# Altium project FlexV1.PrjPcb (part 1 of 3)
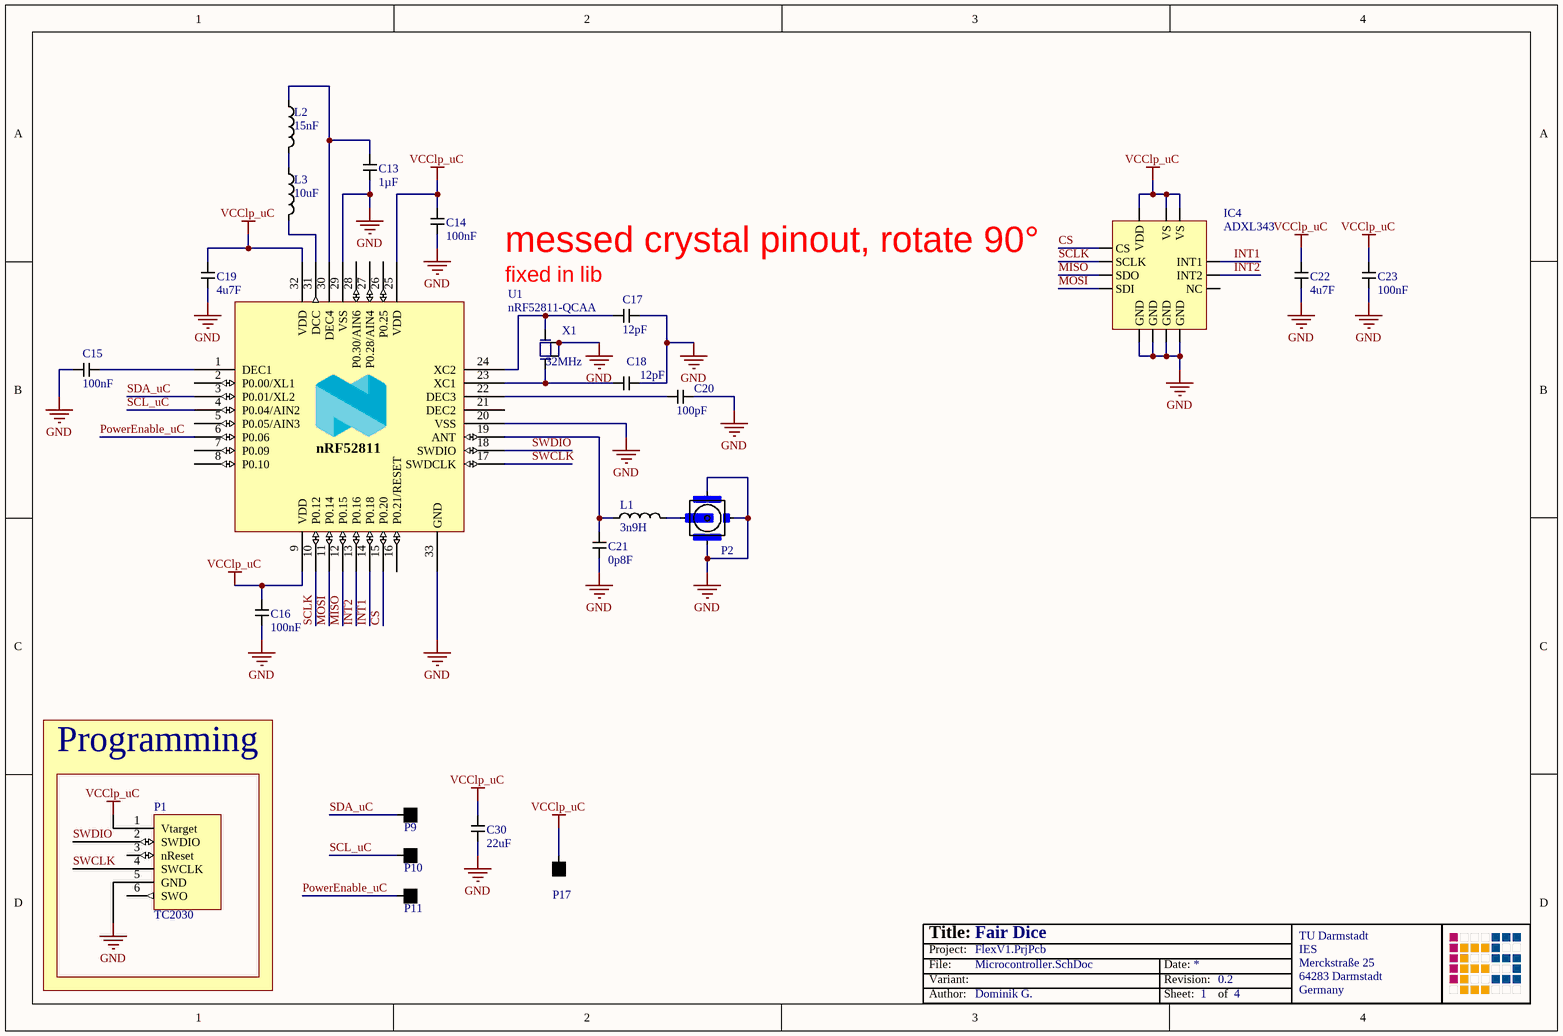
[diagram p0: Microcontroller.SchDoc]
ProjectAuthor: Dominik G.; ProjectRevision: 0.2; ProjectTitle: Fair Dice
4 sheets, 484 parts. Net scope: global (net labels, ports and power ports of the same name join across sheets).
Board files: FlexV1.PcbDoc, FlexV1_PanelV2.PcbDoc, FlexV1_Panel.PcbDoc
Sheets:
  Microcontroller.SchDoc
  LEDController.SchDoc
  PowerMM.SchDoc
  LEDs.SchDoc

## Sheet Microcontroller.SchDoc
size A4; Organization: TU Darmstadt; Address1: IES; Address2: Merckstraße 25; Address3: 64283 Darmstadt; Address4: Germany; SheetNumber: 1; SheetTotal: 4

### Parts
C13  1µF  [CL10B104KB8NNNC]
C14  100nF  [CL10B104KB8NNNC]
C15  100nF  [CL10B104KB8NNNC]
C16  100nF  [CL10B104KB8NNNC]
C17  12pF  [CL10B104KB8NNNC]
C18  12pF  [CL10B104KB8NNNC]
C19  4u7F  [C0805]
C20  100pF  [CL10B104KB8NNNC]
C21  0p8F  [CL10B104KB8NNNC]
C22  4u7F  [C0805]
C23  100nF  [CL10B104KB8NNNC]
C30  22uF  [C0805]
IC4  ADXL343  [ADXL343]
L1  3n9H  [LQW18AN3N9B80D]
L2  15nF  [RC0603]
L3  10uF  [RC0603]
P1  TC2030  [TAG_CONNECT]  (no BOM)
P2  73412-0110  [UFL]  (value not drawn)
P9  Solderpad  [SolderPad]  (value not drawn)  (no BOM)
P10  Solderpad  [SolderPad]  (value not drawn)  (no BOM)
P11  Solderpad  [SolderPad]  (value not drawn)  (no BOM)
P17  Solderpad  [SolderPad]  (value not drawn)  (no BOM)
U1  nRF52811-QCAA  [Nordic_QFN50P500X500X90-33N]
X1  32MHz  [R2520-32.000-8-F-1030-EXT-TR]

### Blocks framed on the sheet
Programming: P1

### Nets
GND: C13.1 C14.1 C15.2 C16.1 C17.2 C18.2 C19.1 C20.2 C21.1 C22.1 C23.1 C30.1 IC4.2(GND) IC4.4(GND) IC4.5(GND) IC4.11(GND) P1.5(GND) P2.2(Vout) P2.3(Vout) P2.4(Vout) U1.20(VSS) U1.29(VSS) U1.33(GND) X1.2(GND) X1.4(GND)
VCClp_uC: C14.2 C16.2 C19.2 C22.2 C23.2 C30.2 IC4.1(VDD) IC4.3(VS) IC4.6(VS) P1.1(Vtarget) P17.1 U1.9(VDD) U1.25(VDD) U1.32(VDD)
CS: IC4.7(CS) U1.15(P0.20)
INT1: IC4.8(INT1) U1.14(P0.18)
INT2: IC4.9(INT2) U1.13(P0.16)
MISO: IC4.12(SDO) U1.12(P0.15)
MOSI: IC4.13(SDI) U1.11(P0.14)
PowerEnable_uC: P11.1 U1.6(P0.06)
SCL_uC: P10.1 U1.4(P0.04/AIN2)
SCLK: IC4.14(SCLK) U1.10(P0.12)
SDA_uC: P9.1 U1.3(P0.01/XL2)
SWCLK: P1.4(SWCLK) U1.17(SWDCLK)
SWDIO: P1.2(SWDIO) U1.18(SWDIO)
NetC13_2: C13.2 L2.1(X) U1.30(DEC4)
NetC15_1: C15.1 U1.1(DEC1)
NetC17_1: C17.1 U1.24(XC2) X1.3(HOT)
NetC18_1: C18.1 U1.23(XC1) X1.1(HOT)
NetC20_1: C20.1 U1.22(DEC3)
NetC21_2: C21.2 L1.1(X) U1.19(ANT)
NetL1_2: L1.2(X) P2.1(Vout)
NetL2_2: L2.2(X) L3.1(X)
NetL3_2: L3.2(X) U1.31(DCC)

Not connected (* = marked no-connect by the designer): IC4 10(NC); P1 3(nReset) 6(SWO); U1 2(P0.00/XL1) 5(P0.05/AIN3) 7(P0.09) 8(P0.10) 16(P0.21/RESET) 21(DEC2) 26(P0.25) 27(P0.28/AIN4) 28(P0.30/AIN6)

### Notes on the sheet
- (near IC4) messed crystal pinout, rotate 90°
- fixed in lib
- Title:
- File:
- Project:
- Variant:
- Date:
- Revision:
- Author:
- Sheet:
- of
- (in symbol nRF52811_QCAA) nRF52811

### Library data of the parts
C13 = CL10A105KA8NNNC: Cap Ceramic 1uF 25V X5R 10% Pad SMD 0603 85°C T/R; Manufacturer: Samsung; Supplier 1: Digi-Key; Manufacturer Part Number: CL10A105KA8NNNC; Stock 1: 5127242; Pricing 1: 1 = 0,100000, 10 = 0,041000, 100 = 0,018500, 500 = 0,013200, 1000 = 0,010370 (USD); RoHS: Yes; Mount: Surface Mount; Case/Package: 0603; Case Code (Metric): 1608; Case Code (Imperial): 0603; Material: Ceramic; Contact Plating: Tin; Min Operating Temperature: -55°C; Max Operating Temperature: 85°C; Capacitance: 1uF; Tolerance: 10%; Dielectric: X5R; Voltage: 25V; Voltage Rating (DC): 25V; Packaging: Tape and Reel; Package Quantity: 1; Voltage Rating: 25V; Length: 1.6mm; Height: 0.8mm; Depth: 0.8mm; Width: 0.031inch; Thickness: 0.035inch; Radiation Hardening: No; Lead Free: Lead Free; ComponentLink1URL: https://datasheet.ciiva.com/25801/cl10a105ka8nnnc-25801364.pdf?src-supplier=Digi-Key; ComponentLink1Description: https://datasheet.ciiva.com/25801/cl10a105ka8nnnc-25801364.pdf?src-supplier=Digi-Key; ComponentLink2URL: https://datasheet.ciiva.com/26838/getdatasheetpartid-357530-26838332.pdf?src-supplier=Verical; ComponentLink2Description: https://datasheet.ciiva.com/26838/getdatasheetpartid-357530-26838332.pdf?src-supplier=Verical; ComponentLink3URL: https://datasheet.ciiva.com/29198/458162-da-01-en-vs-kondensator-0603-29198475.pdf?src-supplier=Conrad; ComponentLink3Description: https://datasheet.ciiva.com/29198/458162-da-01-en-vs-kondensator-0603-29198475.pdf?src-supplier=Conrad; Supplier Part Number 1: 1276-1102-1-ND
C14-C16 C23 = CL10B104KB8NNNC: Capacitor: ceramic; MLCC; 100nF; 50V; X7R; ±10%; SMD; 0603; -55÷125°C; Manufacturer: Samsung; Supplier 1: Digi-Key; Manufacturer Part Number: CL10B104KB8NNNC; Stock 1: 12121642; Pricing 1: 1 = 0,10000, 10 = 0,02800, 100 = 0,01230, 500 = 0,00878, 1000 = 0,00690 (USD); RoHS: Yes; Mount: Surface Mount; Case/Package: 0603; Case Code (Metric): 1608; Case Code (Imperial): 0603; Material: Ceramic; Contact Plating: Tin; Min Operating Temperature: -55°C; Max Operating Temperature: 125°C; Tolerance: 10%; Package Quantity: 1; Packaging: Tape and Reel; Capacitance: 100nF; Dielectric: X7R; Voltage Rating: 50V; Voltage: 50V; Voltage Rating (DC): 50V; Length: 1.6mm; Height: 0.8mm; Width: 0.031inch; Depth: 0.8mm; Thickness: 0.035inch; Radiation Hardening: No; Lead Free: Lead Free; ComponentLink1URL: https://datasheet.ciiva.com/25803/cl10b104kb8nnnc-25803393.pdf?src-supplier=Digi-Key; ComponentLink1Description: https://datasheet.ciiva.com/25803/cl10b104kb8nnnc-25803393.pdf?src-supplier=Digi-Key; ComponentLink2URL: https://datasheet.ciiva.com/26838/getdatasheetpartid-89097-26838411.pdf?src-supplier=Verical; ComponentLink2Description: https://datasheet.ciiva.com/26838/getdatasheetpartid-89097-26838411.pdf?src-supplier=Verical; ComponentLink3URL: https://datasheet.ciiva.com/29198/456651-da-01-en-vs-kondensator-0605-29198839.pdf?src-supplier=Conrad; ComponentLink3Description: https://datasheet.ciiva.com/29198/456651-da-01-en-vs-kondensator-0605-29198839.pdf?src-supplier=Conrad; Supplier Part Number 1: 1276-1000-1-ND
C17 C18 = CL10C120JB8NNNC: Cap Ceramic 12pF 50VDC C0G 5% SMD 0603 Paper T/R; Manufacturer: Samsung; Voltage: 50V; Temperature Coefficient: 300ppm/°C; Supplier 1: Digi-Key; Manufacturer Part Number: CL10C120JB8NNNC; RoHS: Yes; Category: Ceramic Capacitors; Stock 1: 106067; Pricing 1: 1=0,10000, 10=0,04000, 100=0,01780, 500=0,01274, 1000=0,01001 (USD); Mount: Surface Mount; Case/Package: 0603; Case Code (Metric): 1608; Case Code (Imperial): 0603; Material: Ceramic; Contact Plating: Tin; Min Operating Temperature: -55°C; Max Operating Temperature: 125°C; Tolerance: 5%; Capacitance: 12pF; Dielectric: C0G; Voltage Rating (DC): 50V; Voltage Rating: 50V; Package Quantity: 1; Packaging: Tape and Reel; Length: 1.6mm; Height: 0.8mm; Depth: 0.8mm; Width: 0.031inch; Thickness: 0.035inch; Radiation Hardening: No; Lead Free: Lead Free; ComponentLink1URL: https://datasheet.ciiva.com/25803/cl10c120jb8nnnc-25803312.pdf?src-supplier=Digi-Key; ComponentLink1Description: https://datasheet.ciiva.com/25803/cl10c120jb8nnnc-25803312.pdf?src-supplier=Digi-Key; ComponentLink2URL: https://datasheet.ciiva.com/26838/getdatasheetpartid-640658-26838491.pdf?src-supplier=Verical; ComponentLink2Description: https://datasheet.ciiva.com/26838/getdatasheetpartid-640658-26838491.pdf?src-supplier=Verical; ComponentLink3URL: https://datasheet.ciiva.com/29198/457317-da-01-en-vs-kondensator-0603-29198780.pdf?src-supplier=Conrad; ComponentLink3Description: https://datasheet.ciiva.com/29198/457317-da-01-en-vs-kondensator-0603-29198780.pdf?src-supplier=Conrad; Supplier Part Number 1: 1276-1254-1-ND
C19 C22 = CL21A475KAQNNNE: SAMSUNG ELECTRO-MECHANICS - CL21A475KAQNNNE - SMD Multilayer Ceramic Capacitor, 4.7 µF, 25 V, 0805 [2012 Metric], ± 10%, X5R, CL Series; Voltage Rating (DC): 25V; Capacitance: 4.7uF; Supplier 1: Digi-Key; Manufacturer: Samsung; Manufacturer Part Number: CL21A475KAQNNNE; RoHS: Yes; Category: Ceramic Capacitors; Stock 1: 481244; Pricing 1: 1=0,14000, 10=0,10000, 100=0,04680, 500=0,03282, 1000=0,02716 (USD); Mount: Surface Mount; Case/Package: 0805; Case Code (Metric): 2012; Case Code (Imperial): 0805; Min Operating Temperature: -55°C; Max Operating Temperature: 85°C; Dielectric: X5R; Package Quantity: 1; Packaging: Tape and Reel; Tolerance: 10%; Voltage Rating: 25V; Length: 2mm; Height: 1.25mm; Thickness: 0.055inch; Depth: 1.25mm; Width: 0.049inch; Radiation Hardening: No; Lead Free: Lead Free; ComponentLink1URL: https://datasheet.ciiva.com/25798/cl21a475kaqnnne-25798882.pdf?src-supplier=Digi-Key; ComponentLink1Description: https://datasheet.ciiva.com/25798/cl21a475kaqnnne-25798882.pdf?src-supplier=Digi-Key; Supplier Part Number 1: 1276-1244-1-ND
C20 = CL10B101KB8NNNC: CAP CER 100PF 50V X7R 0603; Manufacturer: Samsung; Tolerance: 10%; Supplier 1: Digi-Key; Manufacturer Part Number: CL10B101KB8NNNC; RoHS: Yes; Category: Ceramic Capacitors; Stock 1: 202639; Pricing 1: 1=0,10000, 10=0,05000, 100=0,02240, 500=0,01602, 1000=0,01258 (USD); Mount: Surface Mount; Case/Package: 0603; Case Code (Imperial): 0603; Case Code (Metric): 1608; Min Operating Temperature: -55°C; Max Operating Temperature: 125°C; Dielectric: X7R; Capacitance: 100pF; Packaging: Tape and Reel; Package Quantity: 1; Voltage Rating: 50V; Length: 1.6mm; Height: 0.8mm; Thickness: 0.035inch; Depth: 0.8mm; Width: 0.031inch; Radiation Hardening: No; ComponentLink1URL: https://datasheet.ciiva.com/26920/getdatasheetpartid-690677-26920180.pdf?src-supplier=Verical; ComponentLink1Description: https://datasheet.ciiva.com/26920/getdatasheetpartid-690677-26920180.pdf?src-supplier=Verical; ComponentLink2URL: https://datasheet.ciiva.com/16437/cl05b104kq5nnnc-16437324.pdf?src-supplier=Future+Electronics; ComponentLink2Description: https://datasheet.ciiva.com/16437/cl05b104kq5nnnc-16437324.pdf?src-supplier=Future+Electronics; Supplier Part Number 1: 1276-1909-1-ND
C21 = CBR06C808BAGAC: CAP CER 0.8PF 250V C0G/NP0 0603; Manufacturer: KEMET; Dielectric: C0G; Supplier 1: Digi-Key; Manufacturer Part Number: CBR06C808BAGAC; RoHS: Yes; Category: Ceramic Capacitors; Stock 1: 2795; Pricing 1: 1=0,54000, 10=0,37200, 100=0,22310, 500=0,16736, 1000=0,14133 (USD); Mount: Surface Mount; Case/Package: 0603; Weight: 7.1E-05oz; Case Code (Metric): 1608; Case Code (Imperial): 0603; Min Operating Temperature: -55°C; Max Operating Temperature: 125°C; Voltage Rating (DC): 250V; Packaging: Tape and Reel; Package Quantity: 1; Capacitance: 0.8pF; Voltage Rating: 250V; Termination: SMD/SMT; Length: 0.063inch; Height: 0.8mm; Width: 0.031inch; Thickness: 0.034inch; ComponentLink1URL: https://datasheet.ciiva.com/6257/kem-c1030-cbr-smd-6257781.pdf?src-supplier=Digi-Key; ComponentLink1Description: https://datasheet.ciiva.com/6257/kem-c1030-cbr-smd-6257781.pdf?src-supplier=Digi-Key; ComponentLink2URL: https://datasheet.ciiva.com/6257/kem-c1030-cbr-smd-6257783.pdf?src-supplier=Digi-Key; ComponentLink2Description: https://datasheet.ciiva.com/6257/kem-c1030-cbr-smd-6257783.pdf?src-supplier=Digi-Key; Supplier Part Number 1: 399-8836-1-ND
C30 = C2012X7S1A226M125AC: TDK - C2012X7S1A226M125AC - SMD Multilayer Ceramic Capacitor, 22 µF, 10 V, 0805 [2012 Metric], ± 20%, X7S, C Series TDK; Voltage Rating (DC): 10V; Supplier 1: Digi-Key; Manufacturer: TDK; Manufacturer Part Number: C2012X7S1A226M125AC; RoHS: Yes; Category: Ceramic Capacitors; Stock 1: 665121; Pricing 1: 1=0,97000, 10=0,74000, 100=0,52940, 500=0,40986, 1000=0,35294 (USD); Mount: Surface Mount; Case/Package: 0805; Weight: 0.000194oz; Case Code (Imperial): 0805; Dielectric Material: Ceramic; Case Code (Metric): 2012; Min Operating Temperature: -55°C; Max Operating Temperature: 125°C; Termination: SMD/SMT; Package Quantity: 2000; Packaging: Tape and Reel; Capacitance: 22uF; Tolerance: 20%; Voltage Rating: 10V; Dielectric: X7S; Length: 0.079inch; Height: 1.25mm; Width: 1.25mm; Thickness: 0.057inch; Lead Free: Lead Free; REACH SVHC: No SVHC; ComponentLink1URL: https://datasheet.ciiva.com/14893/tdkmlcccaprange-14893287.pdf?src-supplier=Digi-Key; ComponentLink1Description: https://datasheet.ciiva.com/14893/tdkmlcccaprange-14893287.pdf?src-supplier=Digi-Key; ComponentLink2URL: https://datasheet.ciiva.com/14893/tdkmlcccaprange-14893288.pdf?src-supplier=Digi-Key; ComponentLink2Description: https://datasheet.ciiva.com/14893/tdkmlcccaprange-14893288.pdf?src-supplier=Digi-Key; ComponentLink3URL: https://datasheet.ciiva.com/14893/tdkmlcccaprange-14893289.pdf?src-supplier=Digi-Key; ComponentLink3Description: https://datasheet.ciiva.com/14893/tdkmlcccaprange-14893289.pdf?src-supplier=Digi-Key; Supplier Part Number 1: 445-14560-1-ND
IC4 = ADXL343BCCZ-RL: ACCEL 2-16G I2C/SPI 14LGA; Manufacturer: Analog Devices; Max Supply Voltage: 3.6V; Min Supply Voltage: 2V; Nominal Supply Current: 140uA; Bandwidth: 0.05Hz; -3db Bandwidth: 320Hz; Output Type: Digital; Axis: X, Y, Z; Sensitivity: 256LSB/g; Supplier 1: Digi-Key; Manufacturer Part Number: ADXL343BCCZ-RL; RoHS: Yes; Category: Sensors; Stock 1: 1661; Pricing 1: 1=3,50000, 10=3,14200, 25=2,97000, 100=2,57400, 500=2,19120, 1000=1,91400 (USD); Case/Package: LGA; Number of Pins: 14; Contact Plating: Tin,Matte; Min Operating Temperature: -40°C; Max Operating Temperature: 85°C; Package Quantity: 5000; Packaging: Tape and Reel; Lead Free: Contains Lead; ComponentLink1URL: https://datasheet.ciiva.com/6484/adxl343-6484390.pdf?src-supplier=Digi-Key; ComponentLink1Description: https://datasheet.ciiva.com/6484/adxl343-6484390.pdf?src-supplier=Digi-Key; ComponentLink2URL: https://datasheet.ciiva.com/16638/adxl343-16638169.pdf?src-supplier=Avnet+Europe; ComponentLink2Description: https://datasheet.ciiva.com/16638/adxl343-16638169.pdf?src-supplier=Avnet+Europe; Supplier Part Number 1: ADXL343BCCZ-RLCT-ND
L1 = LQW18AN3N9B80D: Ind RF Chip Unshielded Wirewound 3.9nH 0.1nH 100MHz 30Q-Factor Ferrite 2.2A 0603 Paper T/R; Manufacturer: Murata; DC Resistance (DCR): 28mR; Self Resonant Frequency: 10GHz; Supplier 1: Digi-Key; Manufacturer Part Number: LQW18AN3N9B80D; RoHS: Yes; Category: Fixed Inductors; Stock 1: 1312; Pricing 1: 1=0,28000, 10=0,24800, 100=0,17080, 500=0,14594, 1000=0,11178 (USD); Mount: Surface Mount; Case/Package: 0603; Core Material: Ferrite; Min Operating Temperature: -55°C; Max Operating Temperature: 125°C; Packaging: Tape and Reel; Composition: Wirewound; Inductance: 3.9nH; Current Rating: 2.2A; Shielding: Unshielded; Test Frequency: 100MHz; Length: 0.065inch; Width: 0.039inch; Height - Seated (Max): 0.039inch; ComponentLink1URL: https://search.murata.co.jp/Ceramy/image/img/P02/JELF243A-0102.pdf?src-supplier=Digi-Key; ComponentLink1Description: https://search.murata.co.jp/Ceramy/image/img/P02/JELF243A-0102.pdf?src-supplier=Digi-Key; ComponentLink2URL: http://search.murata.co.jp/Ceramy/image/img/P02/JELF243A-0082.pdf?src-supplier=Digi-Key; ComponentLink2Description: http://search.murata.co.jp/Ceramy/image/img/P02/JELF243A-0082.pdf?src-supplier=Digi-Key; Supplier Part Number 1: 490-16894-1-ND
L2 = LQW18AN15NJ10D: Inductor RF Chip Wirewound 15nH 5% 100MHz 42Q-Factor 700mA 85mOhm DCR 0603 Paper T/R; Manufacturer: Murata; Core Material: Non-Magnetic; Q Factor: 42; Self Resonant Frequency: 4.5GHz; DC Resistance (DCR): 85mR; Current: 1A; Shielding: Unshielded; Supplier 1: Digi-Key; Manufacturer Part Number: LQW18AN15NJ10D; RoHS: Yes; Category: Fixed Inductors; Stock 1: 5086; Pricing 1: 1=0,19000, 10=0,17100, 100=0,11390, 500=0,09488, 1000=0,07970 (USD); Mount: Surface Mount; Case/Package: 0603; Weight: 0.000106oz; Case Code (Metric): 1608; Case Code (Imperial): 0603; Min Operating Temperature: -55°C; Max Operating Temperature: 125°C; Packaging: Tape and Reel; Composition: Wirewound; Inductance: 15nH; Test Frequency: 100MHz; Max DC Current: 700mA; Termination: SMD/SMT; DC Current: 700mA; Military Standard: Not; Package Quantity: 4000; Current Rating: 700mA; Tolerance: 5%; Length: 1.6mm; Height: 0.8mm; Height - Seated (Max): 0.039inch; Depth: 1.1mm; Width: 0.031inch; Radiation Hardening: No; ComponentLink1URL: https://datasheet.ciiva.com/11801/0900766b80a002db-11801459.pdf?src-supplier=RSComponents; ComponentLink1Description: https://datasheet.ciiva.com/11801/0900766b80a002db-11801459.pdf?src-supplier=RSComponents; ComponentLink2URL: https://datasheet.ciiva.com/6705/l0075s0080lqw18a-10-6705463.pdf?src-supplier=Digi-Key; ComponentLink2Description: https://datasheet.ciiva.com/6705/l0075s0080lqw18a-10-6705463.pdf?src-supplier=Digi-Key; ComponentLink3URL: https://datasheet.ciiva.com/17247/l0075s0080lqw18a-10-17247742.pdf?src-supplier=Avnet+Europe; ComponentLink3Description: https://datasheet.ciiva.com/17247/l0075s0080lqw18a-10-17247742.pdf?src-supplier=Avnet+Europe; Supplier Part Number 1: 490-6867-1-ND
L3 = MLZ1608N100LT000: Inductor Power Shielded Multi-Layer 10uH 20% 2MHz Ferrite 0.06A 0.78Ohm DCR 0603 T/R; Manufacturer: TDK; DC Resistance (DCR): 780mR; Self Resonant Frequency: 50MHz; Current Rating: 300mA; Saturation Current: 60mA; Supplier 1: Digi-Key; Manufacturer Part Number: MLZ1608N100LT000; RoHS: Yes; Category: Fixed Inductors; Stock 1: 163600; Pricing 1: 1=0,17000, 10=0,15500, 100=0,10350, 500=0,08626, 1000=0,07245 (USD); Mount: Surface Mount; Case/Package: 0603; Case Code (Imperial): 0603; Case Code (Metric): 1608; Core Material: Ferrite; Min Operating Temperature: -55°C; Max Operating Temperature: 125°C; Inductance: 10uH; Test Frequency: 2MHz; Package Quantity: 4000; Packaging: Tape and Reel; Tolerance: 20%; Shielding: Shielded; Length: 0.063inch; Height - Seated (Max): 0.037inch; Width: 0.031inch; Lead Free: Lead Free; ComponentLink1URL: https://datasheet.ciiva.com/29698/inductor-commercial-decoupling-mlz-en-29698853.pdf?src-supplier=Digi-Key; ComponentLink1Description: https://datasheet.ciiva.com/29698/inductor-commercial-decoupling-mlz-en-29698853.pdf?src-supplier=Digi-Key; ComponentLink2URL: https://datasheet.ciiva.com/29698/inductor-commercial-decoupling-mlz-en-29698854.pdf?src-supplier=Digi-Key; ComponentLink2Description: https://datasheet.ciiva.com/29698/inductor-commercial-decoupling-mlz-en-29698854.pdf?src-supplier=Digi-Key; ComponentLink3URL: https://datasheet.ciiva.com/29698/inductor-commercial-decoupling-mlz-en-29698855.pdf?src-supplier=Digi-Key; ComponentLink3Description: https://datasheet.ciiva.com/29698/inductor-commercial-decoupling-mlz-en-29698855.pdf?src-supplier=Digi-Key; Supplier Part Number 1: 445-6755-1-ND
P2 = 73412-0110: MOLEX   73412-0110   RF COAXIAL, MICROCOAXIAL, JACK, 50OHM; Body Material: Polymer,Liquid Crystal Polymer; Body Plating: Gold; Impedance: 50R; Voltage Rating: 60V; Frequency: 6GHz; Gender: Female; Mating Cycles: 30; Insulation Resistance: 500MR; Polarity: Standard; Supplier 1: Digi-Key; Manufacturer: Molex; Manufacturer Part Number: 73412-0110; RoHS: Yes; Category: RF / Coaxial Connectors; Stock 1: 79788; Pricing 1: 1=0,77000, 10=0,72200, 25=0,64960, 50=0,57740, 100=0,55330, 250=0,50520, 500=0,48114, 1000=0,39694, 2500=0,36086 (USD); Mount: Surface Mount,Through Hole,PCB; Contact Material: Bronze,Brass; Contact Plating: Gold; Material: Bronze; Min Operating Temperature: -40°C; Max Operating Temperature: 90°C; Package Quantity: 5000; Packaging: Tape and Reel; Max Frequency: 6GHz; Termination: Solder; Connector Type: Coaxial; Voltage Rating (AC): 60V; Orientation: Straight; Radiation Hardening: No; REACH SVHC: Unknown; Halogen Free: Low Halogen; Lead Free: Lead Free; ComponentLink1URL: https://datasheet.ciiva.com/30219/250360734120110-rf-coax-nectors-30219809.pdf?src-supplier=Onlinecomponents.com; ComponentLink1Description: https://datasheet.ciiva.com/30219/250360734120110-rf-coax-nectors-30219809.pdf?src-supplier=Onlinecomponents.com; ComponentLink2URL: https://datasheet.ciiva.com/16653/0734120110-rf-coax-connectors-16653186.pdf?src-supplier=Avnet+Europe; ComponentLink2Description: https://datasheet.ciiva.com/16653/0734120110-rf-coax-connectors-16653186.pdf?src-supplier=Avnet+Europe; ComponentLink3URL: https://datasheet.ciiva.com/11762/0900766b80dfdeb4-11762356.pdf?src-supplier=RSComponents; ComponentLink3Description: https://datasheet.ciiva.com/11762/0900766b80dfdeb4-11762356.pdf?src-supplier=RSComponents; ComponentLink4URL: https://datasheet.ciiva.com/22773/1841262-22773140.pdf?src-supplier=Farnell; ComponentLink4Description: https://datasheet.ciiva.com/22773/1841262-22773140.pdf?src-supplier=Farnell; ComponentLink5URL: https://datasheet.ciiva.com/4600/0734120110-rf-coax-connectors-173239-4600647.pdf?src-supplier=Mouser; ComponentLink5Description: https://datasheet.ciiva.com/4600/0734120110-rf-coax-connectors-173239-4600647.pdf?src-supplier=Mouser; ComponentLink6URL: https://datasheet.ciiva.com/16081/1387750734120110-rf-coax-nectors-16081145.pdf?src-supplier=Onlinecomponents.com; ComponentLink6Description: https://datasheet.ciiva.com/16081/1387750734120110-rf-coax-nectors-16081145.pdf?src-supplier=Onlinecomponents.com; ComponentLink7URL: https://datasheet.ciiva.com/46384/1808577-46384459.pdf?src-supplier=Element14; ComponentLink7Description: https://datasheet.ciiva.com/46384/1808577-46384459.pdf?src-supplier=Element14; ComponentLink8URL: https://datasheet.ciiva.com/9419/0734120110-rf-coax-connectors-9419357.pdf?src-supplier=Avnet; ComponentLink8Description: https://datasheet.ciiva.com/9419/0734120110-rf-coax-connectors-9419357.pdf?src-supplier=Avnet; Supplier Part Number 1: WM5587CT-ND
U1 = nRF52811_QCAA: Multi-protocol Bluetooth Low Energy, IEEE 802.15.4, ANT and 2.4GHz proprietary system-on-chip; Part Number: nRF52811-QCAAA0; Manufacturer: Nordic Semiconductor; Manufacturer Part Number: nRF52811-QCAAA0; LatestRevisionDate: 2019-01-30; Pin Count: 32; Publisher: Nordic Semiconductor; Published: 2019-01-30; Value: nRF52811-QCAA; Footprint Doc: QFN-32
X1 = R2520-32.000-8-F-1030-EXT-TR: Xtal 32MHZ 8PF SMD; Manufacturer: Raltron Electronics; Supplier 1: Digi-Key; Manufacturer Part Number: R2520-32.000-8-F-1030-EXT-TR; Stock 1: 2968; Pricing 1: 1=0,68000, 10=0,59800, 50=0,55900, 100=0,49400, 500=0,46800, 1000=0,39000 (USD); ComponentLink1URL: http://datasheet.octopart.com/R2520-32.000-8-F-1030-EXT-TR-Raltron-Electronics-datasheet-137142235.pdf?src-supplier=Raltron+Electronics; ComponentLink1Description: http://datasheet.octopart.com/R2520-32.000-8-F-1030-EXT-TR-Raltron-Electronics-datasheet-137142235.pdf?src-supplier=Raltron+Electronics; ComponentLink2URL: http://datasheet.octopart.com/R2520-32.000-8-F-1030-EXT-TR-Raltron-Electronics-datasheet-140254835.pdf?src-supplier=Raltron+Electronics; ComponentLink2Description: http://datasheet.octopart.com/R2520-32.000-8-F-1030-EXT-TR-Raltron-Electronics-datasheet-140254835.pdf?src-supplier=Raltron+Electronics; Supplier Part Number 1: 2151-R2520-32.000-8-F-1030-EXT-TRCT-ND
P1 = TC2030: Supplier 1: Tag-Connect; Supplier Part Number 1: TC2030-CTX-20-NL

## Sheet LEDController.SchDoc
size A4; Organization: TU Darmstadt; Address1: IES; Address2: Merckstraße 25; Address3: 64283 Darmstadt; Address4: Germany
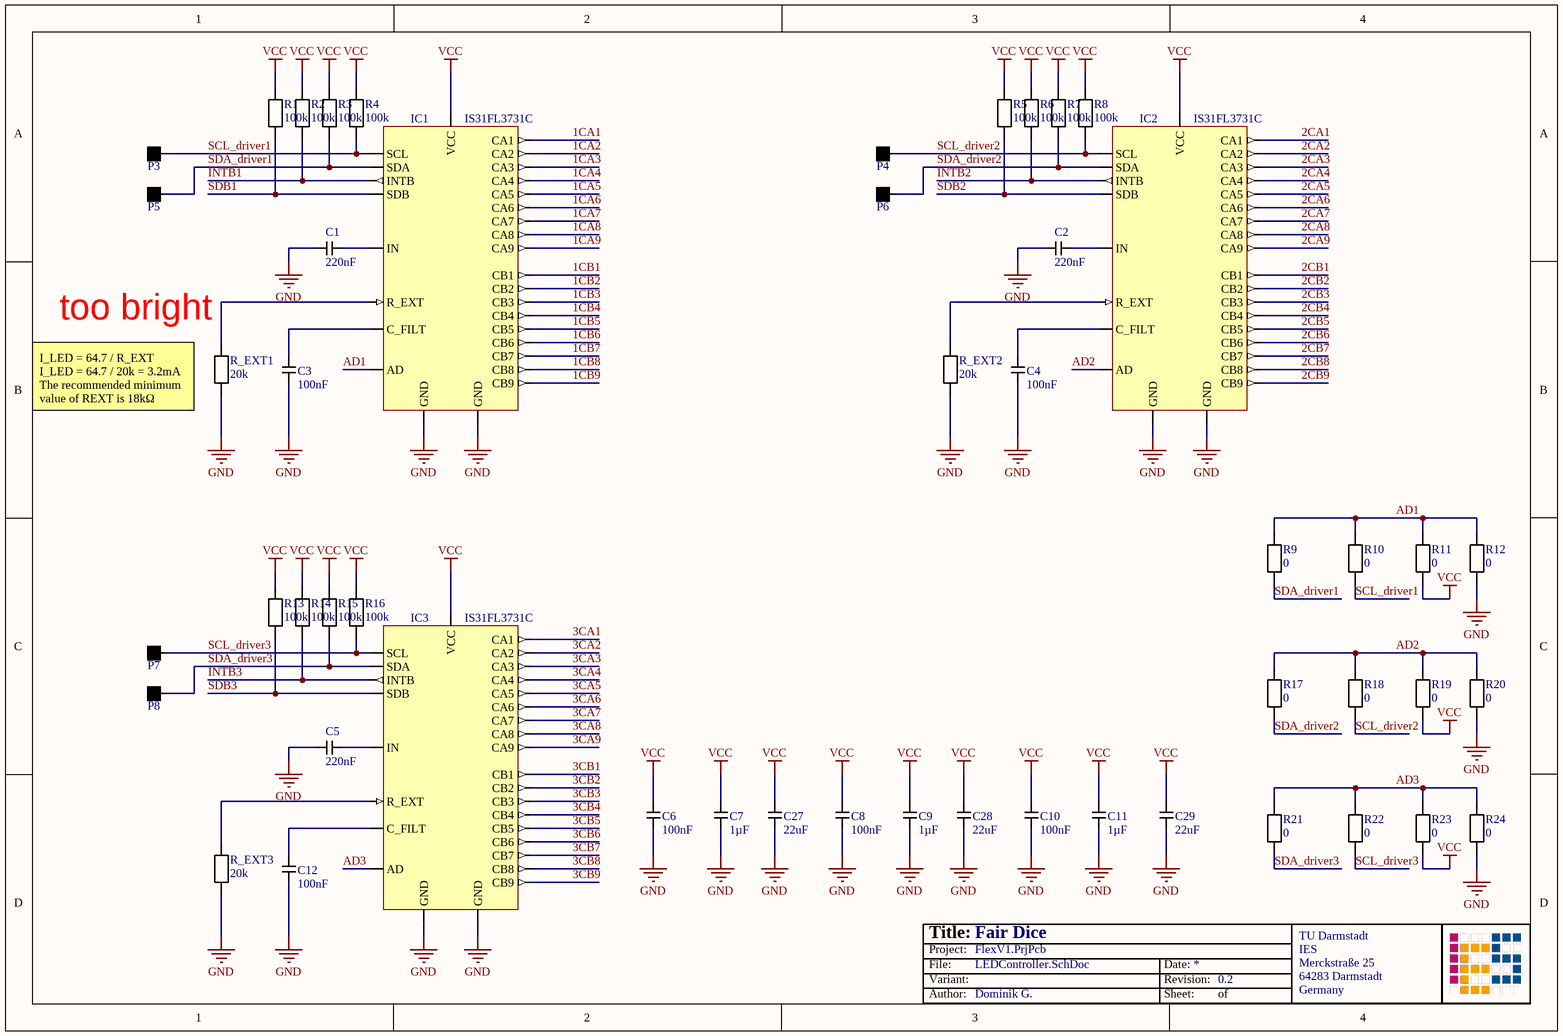
[diagram p1: LEDController.SchDoc]

### Parts
C1  220nF  [RC0402]
C2  220nF  [RC0402]
C3  100nF  [CL10B104KB8NNNC]
C4  100nF  [CL10B104KB8NNNC]
C5  220nF  [RC0402]
C6  100nF  [CL10B104KB8NNNC]
C7  1µF  [CL10B104KB8NNNC]
C8  100nF  [CL10B104KB8NNNC]
C9  1µF  [CL10B104KB8NNNC]
C10  100nF  [CL10B104KB8NNNC]
C11  1µF  [CL10B104KB8NNNC]
C12  100nF  [CL10B104KB8NNNC]
C27  22uF  [C0805]
C28  22uF  [C0805]
C29  22uF  [C0805]
IC1  IS31FL3731C  [IS31FL3731]
IC2  IS31FL3731C  [IS31FL3731]
IC3  IS31FL3731C  [IS31FL3731]
P3  Solderpad  [SolderPad]  (value not drawn)  (no BOM)
P4  Solderpad  [SolderPad]  (value not drawn)  (no BOM)
P5  Solderpad  [SolderPad]  (value not drawn)  (no BOM)
P6  Solderpad  [SolderPad]  (value not drawn)  (no BOM)
P7  Solderpad  [SolderPad]  (value not drawn)  (no BOM)
P8  Solderpad  [SolderPad]  (value not drawn)  (no BOM)
R1  100k  [RC0603]
R2  100k  [RC0603]
R3  100k  [RC0603]
R4  100k  [RC0603]
R5  100k  [RC0603]
R6  100k  [RC0603]
R7  100k  [RC0603]
R8  100k  [RC0603]
R9  0  [RC0402]
R10  0  [RC0402]
R11  0  [RC0402]
R12  0  [RC0402]
R13  100k  [RC0603]
R14  100k  [RC0603]
R15  100k  [RC0603]
R16  100k  [RC0603]
R17  0  [RC0402]
R18  0  [RC0402]
R19  0  [RC0402]
R20  0  [RC0402]
R21  0  [RC0402]
R22  0  [RC0402]
R23  0  [RC0402]
R24  0  [RC0402]
R_EXT1  20k  [RC0603]
R_EXT2  20k  [RC0603]
R_EXT3  20k  [RC0603]

### Nets
GND: C1.1 C2.1 C3.1 C4.1 C5.1 C6.1 C7.1 C8.1 C9.1 C10.1 C11.1 C12.1 C27.1 C28.1 C29.1 IC1.5(GND) IC1.29(GND) IC2.5(GND) IC2.29(GND) IC3.5(GND) IC3.29(GND) R12.1 R20.1 R24.1 R_EXT1.2 R_EXT2.2 R_EXT3.2
VCC: C6.2 C7.2 C8.2 C9.2 C10.2 C11.2 C27.2 C28.2 C29.2 IC1.2(VCC) IC2.2(VCC) IC3.2(VCC) R1.2 R2.2 R3.2 R4.2 R5.2 R6.2 R7.2 R8.2 R11.1 R13.2 R14.2 R15.2 R16.2 R19.1 R23.1
1CA1: IC1.21(CA1)
1CA2: IC1.22(CA2)
1CA3: IC1.23(CA3)
1CA4: IC1.24(CA4)
1CA5: IC1.25(CA5)
1CA6: IC1.26(CA6)
1CA7: IC1.27(CA7)
1CA8: IC1.28(CA8)
1CA9: IC1.1(CA9)
1CB1: IC1.7(CB1)
1CB2: IC1.8(CB2)
1CB3: IC1.9(CB3)
1CB4: IC1.10(CB4)
1CB5: IC1.11(CB5)
1CB6: IC1.12(CB6)
1CB7: IC1.13(CB7)
1CB8: IC1.14(CB8)
1CB9: IC1.15(CB9)
2CA1: IC2.21(CA1)
2CA2: IC2.22(CA2)
2CA3: IC2.23(CA3)
2CA4: IC2.24(CA4)
2CA5: IC2.25(CA5)
2CA6: IC2.26(CA6)
2CA7: IC2.27(CA7)
2CA8: IC2.28(CA8)
2CA9: IC2.1(CA9)
2CB1: IC2.7(CB1)
2CB2: IC2.8(CB2)
2CB3: IC2.9(CB3)
2CB4: IC2.10(CB4)
2CB5: IC2.11(CB5)
2CB6: IC2.12(CB6)
2CB7: IC2.13(CB7)
2CB8: IC2.14(CB8)
2CB9: IC2.15(CB9)
3CA1: IC3.21(CA1)
3CA2: IC3.22(CA2)
3CA3: IC3.23(CA3)
3CA4: IC3.24(CA4)
3CA5: IC3.25(CA5)
3CA6: IC3.26(CA6)
3CA7: IC3.27(CA7)
3CA8: IC3.28(CA8)
3CA9: IC3.1(CA9)
3CB1: IC3.7(CB1)
3CB2: IC3.8(CB2)
3CB3: IC3.9(CB3)
3CB4: IC3.10(CB4)
3CB5: IC3.11(CB5)
3CB6: IC3.12(CB6)
3CB7: IC3.13(CB7)
3CB8: IC3.14(CB8)
3CB9: IC3.15(CB9)
AD1: IC1.18(AD) R9.2 R10.2 R11.2 R12.2
AD2: IC2.18(AD) R17.2 R18.2 R19.2 R20.2
AD3: IC3.18(AD) R21.2 R22.2 R23.2 R24.2
INTB1: IC1.4(INTB) R2.1
INTB2: IC2.4(INTB) R6.1
INTB3: IC3.4(INTB) R14.1
SCL_driver1: IC1.20(SCL) P3.1 R4.1 R10.1
SCL_driver2: IC2.20(SCL) P4.1 R8.1 R18.1
SCL_driver3: IC3.20(SCL) P7.1 R16.1 R22.1
SDA_driver1: IC1.19(SDA) P5.1 R3.1 R9.1
SDA_driver2: IC2.19(SDA) P6.1 R7.1 R17.1
SDA_driver3: IC3.19(SDA) P8.1 R15.1 R21.1
SDB1: IC1.3(SDB) R1.1
SDB2: IC2.3(SDB) R5.1
SDB3: IC3.3(SDB) R13.1
NetC1_2: C1.2 IC1.17(IN)
NetC2_2: C2.2 IC2.17(IN)
NetC3_2: C3.2 IC1.16(C_FILT)
NetC4_2: C4.2 IC2.16(C_FILT)
NetC5_2: C5.2 IC3.17(IN)
NetC12_2: C12.2 IC3.16(C_FILT)
NetIC1_6: IC1.6(R_EXT) R_EXT1.1
NetIC2_6: IC2.6(R_EXT) R_EXT2.1
NetIC3_6: IC3.6(R_EXT) R_EXT3.1

### Notes on the sheet
- (near R_EXT1) too bright
- (near R_EXT1) I_LED = 64.7 / R_EXT
  I_LED = 64.7 / 20k = 3.2mA
  The recommended minimum value of REXT is 18kΩ
- Title:
- File:
- Project:
- Variant:
- Date:
- Revision:
- Author:
- Sheet:
- of

### Library data of the parts
C1 C2 C5 = CC0402KRX5R6BB224: CAP CER 0.22UF 10V X5R 0402; Manufacturer: Yageo; Dielectric Material: Ceramic; Tolerance: 10%; Supplier 1: Digi-Key; Manufacturer Part Number: CC0402KRX5R6BB224; Stock 1: 215238; Pricing 1: 1 = 0,10000, 10 = 0,05700, 100 = 0,02530, 500 = 0,01808, 1000 = 0,01421, 2500 = 0,01292, 5000 = 0,01188 (USD); RoHS: Yes; Mount: Surface Mount; Case/Package: 0402; Weight: 2.3E-05oz; Case Code (Metric): 1005; Case Code (Imperial): 0402; Min Operating Temperature: -55°C; Max Operating Temperature: 85°C; Package Quantity: 10000; Capacitance: 220nF; Voltage Rating: 10V; Packaging: Tape and Reel; Voltage Rating (DC): 10V; Dielectric: X5R; Termination: SMD/SMT; Composition: Ceramic; Length: 1mm; Height: 0.5mm; Width: 0.02inch; Thickness: 0.022inch; Depth: 0.5mm; Radiation Hardening: No; REACH SVHC: Unknown; Lead Free: Lead Free; Halogen Free: Halogen Free; ComponentLink1URL: https://datasheet.ciiva.com/176/mlccorderingcode-176912.pdf?src-supplier=Digi-Key; ComponentLink1Description: https://datasheet.ciiva.com/176/mlccorderingcode-176912.pdf?src-supplier=Digi-Key; ComponentLink2URL: https://datasheet.ciiva.com/176/mlccorderingcode-176913.pdf?src-supplier=Digi-Key; ComponentLink2Description: https://datasheet.ciiva.com/176/mlccorderingcode-176913.pdf?src-supplier=Digi-Key; ComponentLink3URL: https://datasheet.ciiva.com/8033/1525783-8033653.pdf?src-supplier=Element14; ComponentLink3Description: https://datasheet.ciiva.com/8033/1525783-8033653.pdf?src-supplier=Element14; ComponentLink4URL: https://datasheet.ciiva.com/16624/upy-gphc-x5r-4v-to-50v-12-16624733.pdf?src-supplier=Avnet+Europe; ComponentLink4Description: https://datasheet.ciiva.com/16624/upy-gphc-x5r-4v-to-50v-12-16624733.pdf?src-supplier=Avnet+Europe; ComponentLink5URL: https://datasheet.ciiva.com/28450/1359354-28450298.pdf?src-supplier=Element14; ComponentLink5Description: https://datasheet.ciiva.com/28450/1359354-28450298.pdf?src-supplier=Element14; ComponentLink6URL: https://datasheet.ciiva.com/176/mlccorderingcode-176911.pdf?src-supplier=Digi-Key; ComponentLink6Description: https://datasheet.ciiva.com/176/mlccorderingcode-176911.pdf?src-supplier=Digi-Key; Supplier Part Number 1: 311-1421-1-ND
C3 C4 C6 C8 C10 C12 = CL10B104KB8NNNC: as C14 on sheet Microcontroller; Supplier 1: Digi-Key; Manufacturer Part Number: CL10B104KB8NNNC; Stock 1: 12121642; Pricing 1: 1 = 0,10000, 10 = 0,02800, 100 = 0,01230, 500 = 0,00878, 1000 = 0,00690 (USD); RoHS: Yes; Mount: Surface Mount; Case/Package: 0603; Case Code (Metric): 1608; Case Code (Imperial): 0603; Material: Ceramic; Contact Plating: Tin; Min Operating Temperature: -55°C; Max Operating Temperature: 125°C; Tolerance: 10%; Package Quantity: 1; Packaging: Tape and Reel; Capacitance: 100nF; Dielectric: X7R; Voltage Rating: 50V; Voltage: 50V; Voltage Rating (DC): 50V; Length: 1.6mm; Height: 0.8mm; Width: 0.031inch; Depth: 0.8mm; Thickness: 0.035inch; Radiation Hardening: No; Lead Free: Lead Free; ComponentLink1URL: https://datasheet.ciiva.com/25803/cl10b104kb8nnnc-25803393.pdf?src-supplier=Digi-Key; ComponentLink1Description: https://datasheet.ciiva.com/25803/cl10b104kb8nnnc-25803393.pdf?src-supplier=Digi-Key; ComponentLink2URL: https://datasheet.ciiva.com/26838/getdatasheetpartid-89097-26838411.pdf?src-supplier=Verical; ComponentLink2Description: https://datasheet.ciiva.com/26838/getdatasheetpartid-89097-26838411.pdf?src-supplier=Verical; ComponentLink3URL: https://datasheet.ciiva.com/29198/456651-da-01-en-vs-kondensator-0605-29198839.pdf?src-supplier=Conrad; ComponentLink3Description: https://datasheet.ciiva.com/29198/456651-da-01-en-vs-kondensator-0605-29198839.pdf?src-supplier=Conrad; Supplier Part Number 1: 1276-1000-1-ND
C7 C9 C11 = CL10A105KA8NNNC: as C13 on sheet Microcontroller; Supplier 1: Digi-Key; Manufacturer Part Number: CL10A105KA8NNNC; Stock 1: 5127242; Pricing 1: 1 = 0,100000, 10 = 0,041000, 100 = 0,018500, 500 = 0,013200, 1000 = 0,010370 (USD); RoHS: Yes; Mount: Surface Mount; Case/Package: 0603; Case Code (Metric): 1608; Case Code (Imperial): 0603; Material: Ceramic; Contact Plating: Tin; Min Operating Temperature: -55°C; Max Operating Temperature: 85°C; Capacitance: 1uF; Tolerance: 10%; Dielectric: X5R; Voltage: 25V; Voltage Rating (DC): 25V; Packaging: Tape and Reel; Package Quantity: 1; Voltage Rating: 25V; Length: 1.6mm; Height: 0.8mm; Depth: 0.8mm; Width: 0.031inch; Thickness: 0.035inch; Radiation Hardening: No; Lead Free: Lead Free; ComponentLink1URL: https://datasheet.ciiva.com/25801/cl10a105ka8nnnc-25801364.pdf?src-supplier=Digi-Key; ComponentLink1Description: https://datasheet.ciiva.com/25801/cl10a105ka8nnnc-25801364.pdf?src-supplier=Digi-Key; ComponentLink2URL: https://datasheet.ciiva.com/26838/getdatasheetpartid-357530-26838332.pdf?src-supplier=Verical; ComponentLink2Description: https://datasheet.ciiva.com/26838/getdatasheetpartid-357530-26838332.pdf?src-supplier=Verical; ComponentLink3URL: https://datasheet.ciiva.com/29198/458162-da-01-en-vs-kondensator-0603-29198475.pdf?src-supplier=Conrad; ComponentLink3Description: https://datasheet.ciiva.com/29198/458162-da-01-en-vs-kondensator-0603-29198475.pdf?src-supplier=Conrad; Supplier Part Number 1: 1276-1102-1-ND
C27-C29 = C2012X7S1A226M125AC: as C30 on sheet Microcontroller; Supplier 1: Digi-Key; Manufacturer: TDK; Manufacturer Part Number: C2012X7S1A226M125AC; RoHS: Yes; Category: Ceramic Capacitors; Stock 1: 665121; Pricing 1: 1=0,97000, 10=0,74000, 100=0,52940, 500=0,40986, 1000=0,35294 (USD); Mount: Surface Mount; Case/Package: 0805; Weight: 0.000194oz; Case Code (Imperial): 0805; Dielectric Material: Ceramic; Case Code (Metric): 2012; Min Operating Temperature: -55°C; Max Operating Temperature: 125°C; Termination: SMD/SMT; Package Quantity: 2000; Packaging: Tape and Reel; Capacitance: 22uF; Tolerance: 20%; Voltage Rating: 10V; Dielectric: X7S; Length: 0.079inch; Height: 1.25mm; Width: 1.25mm; Thickness: 0.057inch; Lead Free: Lead Free; REACH SVHC: No SVHC; ComponentLink1URL: https://datasheet.ciiva.com/14893/tdkmlcccaprange-14893287.pdf?src-supplier=Digi-Key; ComponentLink1Description: https://datasheet.ciiva.com/14893/tdkmlcccaprange-14893287.pdf?src-supplier=Digi-Key; ComponentLink2URL: https://datasheet.ciiva.com/14893/tdkmlcccaprange-14893288.pdf?src-supplier=Digi-Key; ComponentLink2Description: https://datasheet.ciiva.com/14893/tdkmlcccaprange-14893288.pdf?src-supplier=Digi-Key; ComponentLink3URL: https://datasheet.ciiva.com/14893/tdkmlcccaprange-14893289.pdf?src-supplier=Digi-Key; ComponentLink3Description: https://datasheet.ciiva.com/14893/tdkmlcccaprange-14893289.pdf?src-supplier=Digi-Key; Supplier Part Number 1: 445-14560-1-ND
IC1-IC3 = IS31FL3731C-QFLS2-TR: LED Lighting Drivers Audio Modulated 144 Dot LED Driver; Manufacturer: ISSI; Number of Outputs: 18; Max Supply Voltage: 5.5V; Output Current per Channel: 34mA; Frequency: 400kHz; Max Supply Current: 2.17mA; High Level Output Current: 5nA; Dimming: Analog; Supplier 1: Digi-Key; Manufacturer Part Number: IS31FL3731C-QFLS2-TR; Stock 1: 2653; Pricing 1: 1 = 2,01000, 10 = 1,81700, 25 = 1,62240, 100 = 1,46000, 250 = 1,29780, 500 = 1,13558, 1000 = 0,94091 (USD); RoHS: Yes; Mount: Surface Mount; Case/Package: QFN; Number of Pins: 28; Weight: 0.002497oz; Min Operating Temperature: -40°C; Max Operating Temperature: 85°C; Packaging: Tape and Reel; Output Current: 34mA; Low Level Output Current: 5nA; Package Quantity: 2500; ComponentLink1URL: http://www.mouser.com/ds/2/198/31FL3731-258525.pdf?src-supplier=Mouser; ComponentLink1Description: http://www.mouser.com/ds/2/198/31FL3731-258525.pdf?src-supplier=Mouser; ComponentLink2URL: http://www.issi.com/WW/pdf/Analog_Part_Decoder.pdf?src-supplier=Digi-Key; ComponentLink2Description: http://www.issi.com/WW/pdf/Analog_Part_Decoder.pdf?src-supplier=Digi-Key; Supplier Part Number 1: 706-1219-1-ND
R1-R8 R13-R16 = RC0603JR-07100KL: RES SMD 100K OHM 5% 1/10W 0603; Manufacturer: Yageo; Resistance: 100kR; Voltage Rating (DC): 50V; Temperature Coefficient: 100ppm/°C; Power Rating: 100mW; Supplier 1: Digi-Key; Manufacturer Part Number: RC0603JR-07100KL; Stock 1: 12318541; Pricing 1: 1 = 0,10000, 10 = 0,02000, 100 = 0,00810, 1000 = 0,00362, 2500 = 0,00314 (USD); RoHS: Yes; Case/Package: 0603; Number of Pins: 2; Contact Plating: Tin; Case Code (Imperial): 0603; Case Code (Metric): 1608; Min Operating Temperature: -55°C; Max Operating Temperature: 155°C; Packaging: Tape and Reel; Tolerance: 5%; Composition: Thick Film; Voltage Rating: 50V; Termination: SMD/SMT; Width: 0.8mm; Radiation Hardening: No; REACH SVHC: No SVHC; Lead Free: Lead Free; ComponentLink1URL: https://datasheet.ciiva.com/7983/443971-7983686.pdf?src-supplier=Element14; ComponentLink1Description: https://datasheet.ciiva.com/7983/443971-7983686.pdf?src-supplier=Element14; ComponentLink2URL: https://datasheet.ciiva.com/7746/443971-7746423.pdf?src-supplier=Element14; ComponentLink2Description: https://datasheet.ciiva.com/7746/443971-7746423.pdf?src-supplier=Element14; ComponentLink3URL: https://datasheet.ciiva.com/7746/443971-7746424.pdf?src-supplier=Element14; ComponentLink3Description: https://datasheet.ciiva.com/7746/443971-7746424.pdf?src-supplier=Element14; ComponentLink4URL: https://datasheet.ciiva.com/8887/pyu-rc0603-51-rohs-l-4-8887903.pdf?src-supplier=Avnet; ComponentLink4Description: https://datasheet.ciiva.com/8887/pyu-rc0603-51-rohs-l-4-8887903.pdf?src-supplier=Avnet; Supplier Part Number 1: 311-100KGRCT-ND
R9-R12 R17-R24 = RC0402JR-070RL: RES SMD 0 OHM JUMPER 1/16W 0402; Manufacturer: Yageo; Resistance: 0mR; Power Rating: 62.5mW; Tolerance: 5%; Voltage Rating: 50V; Max Power Dissipation: 63mW; Temperature Coefficient: 200ppm/°C; Supplier 1: Digi-Key; Manufacturer Part Number: RC0402JR-070RL; Stock 1: 80146051; Pricing 1: 1 = 0,10000, 10 = 0,01500, 25 = 0,01080, 50 = 0,00800, 100 = 0,00600, 250 = 0,00456, 500 = 0,00364, 1000 = 0,00268, 5000 = 0,00192 (USD); RoHS: Yes; Case/Package: 0402; Contact Plating: Tin; Case Code (Metric): 1005; Case Code (Imperial): 0402; Min Operating Temperature: -55°C; Max Operating Temperature: 155°C; Packaging: Tape and Reel; Composition: Thick Film; Package Quantity: 1; Number of Terminations: 2; Termination: SMD/SMT; Military Standard: Not; Features: Moisture Resistant; Length: 1mm; Height: 0.016inch; Width: 0.02inch; Depth: 0.5mm; Radiation Hardening: No; REACH SVHC: Unknown; Lead Free: Lead Free; ComponentLink1URL: https://datasheet.ciiva.com/2452/pyu-rc0402-51-rohs-l-6-2452608.pdf?src-supplier=Digi-Key; ComponentLink1Description: https://datasheet.ciiva.com/2452/pyu-rc0402-51-rohs-l-6-2452608.pdf?src-supplier=Digi-Key; ComponentLink2URL: https://datasheet.ciiva.com/11808/0900766b80c66297-11808195.pdf?src-supplier=RSComponents; ComponentLink2Description: https://datasheet.ciiva.com/11808/0900766b80c66297-11808195.pdf?src-supplier=RSComponents; ComponentLink3URL: https://datasheet.ciiva.com/2452/pyu-r-int-thick-7-2452609.pdf?src-supplier=Digi-Key; ComponentLink3Description: https://datasheet.ciiva.com/2452/pyu-r-int-thick-7-2452609.pdf?src-supplier=Digi-Key; ComponentLink4URL: https://datasheet.ciiva.com/2452/pyu-r-int-thick-7-2452610.pdf?src-supplier=Digi-Key; ComponentLink4Description: https://datasheet.ciiva.com/2452/pyu-r-int-thick-7-2452610.pdf?src-supplier=Digi-Key; ComponentLink5URL: https://datasheet.ciiva.com/8896/pyu-rc0402-51-rohs-l-6-8896201.pdf?src-supplier=Avnet; ComponentLink5Description: https://datasheet.ciiva.com/8896/pyu-rc0402-51-rohs-l-6-8896201.pdf?src-supplier=Avnet; ComponentLink6URL: https://datasheet.ciiva.com/28386/pyu-rc0402-51-rohs-l-6-28386633.pdf?src-supplier=Avnet+Europe; ComponentLink6Description: https://datasheet.ciiva.com/28386/pyu-rc0402-51-rohs-l-6-28386633.pdf?src-supplier=Avnet+Europe; ComponentLink7URL: https://datasheet.ciiva.com/22747/1018594-22747515.pdf?src-supplier=Element14; ComponentLink7Description: https://datasheet.ciiva.com/22747/1018594-22747515.pdf?src-supplier=Element14; ComponentLink8URL: https://datasheet.ciiva.com/15189/getdatasheetpartid-326379-15189533.pdf?src-supplier=Verical; ComponentLink8Description: https://datasheet.ciiva.com/15189/getdatasheetpartid-326379-15189533.pdf?src-supplier=Verical; ComponentLink9URL: https://datasheet.ciiva.com/7983/1018594-7983535.pdf?src-supplier=Element14; ComponentLink9Description: https://datasheet.ciiva.com/7983/1018594-7983535.pdf?src-supplier=Element14; Supplier Part Number 1: 311-0.0JRCT-ND
R_EXT1-R_EXT3 = RC0603FR-0720KL: RES SMD 20K OHM 1% 1/10W 0603; Manufacturer: Yageo; Resistance: 20kR; Temperature Coefficient: 100ppm/°C; Voltage Rating (DC): 50V; Power Rating: 100mW; Supplier 1: Digi-Key; Manufacturer Part Number: RC0603FR-0720KL; Stock 1: 8068424; Pricing 1: 1 = 0,10000, 10 = 0,02400, 100 = 0,00970, 1000 = 0,00437, 2500 = 0,00379 (USD); RoHS: Yes; Case/Package: 0603; Number of Pins: 2; Case Code (Imperial): 0603; Case Code (Metric): 1608; Min Operating Temperature: -55°C; Max Operating Temperature: 155°C; Packaging: Tape and Reel; Tolerance: 1%; Composition: Thick Film; Voltage Rating: 50V; Package Quantity: 1; Termination: SMD/SMT; Number of Terminations: 2; Military Standard: Not; Max Power Dissipation: 100mW; Features: Moisture Resistant; Length: 0.063inch; Height: 0.022inch; Width: 0.031inch; Depth: 0.8mm; Lead Free: Lead Free; REACH SVHC: No SVHC; ComponentLink1URL: https://datasheet.ciiva.com/11808/0900766b80f96399-11808275.pdf?src-supplier=RSComponents; ComponentLink1Description: https://datasheet.ciiva.com/11808/0900766b80f96399-11808275.pdf?src-supplier=RSComponents; ComponentLink2URL: https://datasheet.ciiva.com/22747/443971-22747525.pdf?src-supplier=Element14; ComponentLink2Description: https://datasheet.ciiva.com/22747/443971-22747525.pdf?src-supplier=Element14; ComponentLink3URL: https://datasheet.ciiva.com/2453/pyu-r-int-thick-7-2453910.pdf?src-supplier=Digi-Key; ComponentLink3Description: https://datasheet.ciiva.com/2453/pyu-r-int-thick-7-2453910.pdf?src-supplier=Digi-Key; ComponentLink4URL: https://datasheet.ciiva.com/2453/pyu-r-int-thick-7-2453911.pdf?src-supplier=Digi-Key; ComponentLink4Description: https://datasheet.ciiva.com/2453/pyu-r-int-thick-7-2453911.pdf?src-supplier=Digi-Key; ComponentLink5URL: https://datasheet.ciiva.com/2453/pyu-r-int-thick-7-2453912.pdf?src-supplier=Digi-Key; ComponentLink5Description: https://datasheet.ciiva.com/2453/pyu-r-int-thick-7-2453912.pdf?src-supplier=Digi-Key; Supplier Part Number 1: 311-20.0KHRCT-ND